# EAGLE design layout (EAGLE 9.6.2)
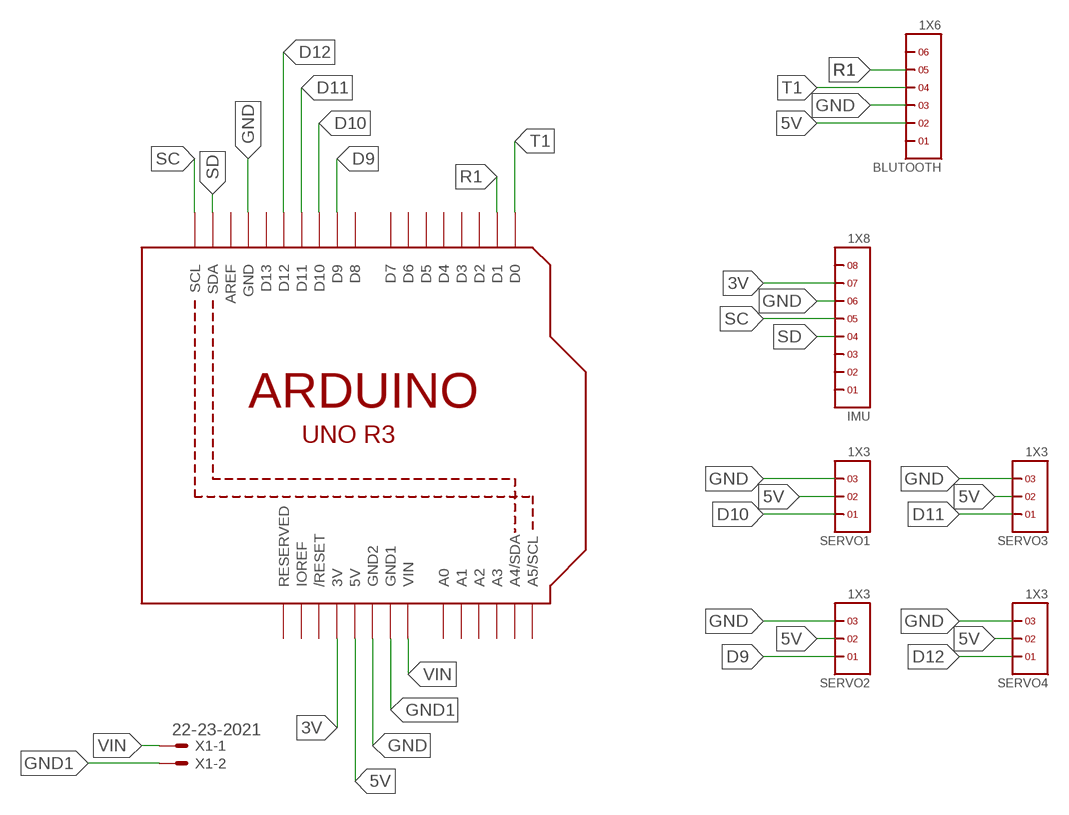
[diagram p0: schematic, sheet 1]

## Parts
BLUTOOTH  1X6  [1X6]
IMU  1X8  [1X8]
SERVO1  1X3  [1X3]
SERVO2  1X3  [1X3]
SERVO3  1X3  [1X3]
SERVO4  1X3  [1X3]
U1  ARDUINOR3-DIMENSION  [ARDUINOR3]
X1  22-23-2021  [22-23-2021]

## Nets
3V: IMU.7 U1.3V
5V: BLUTOOTH.2 SERVO1.2 SERVO2.2 SERVO3.2 SERVO4.2 U1.5V
D9: SERVO2.1 U1.D9
D10: SERVO1.1 U1.D10
D11: SERVO3.1 U1.D11
D12: SERVO4.1 U1.D12
GND: BLUTOOTH.3 IMU.6 SERVO1.3 SERVO2.3 SERVO3.3 SERVO4.3 U1.GND U1.GND2
GND1: U1.GND1 X1.2
R1: BLUTOOTH.5 U1.D1
SC: IMU.5 U1.SCL
SD: IMU.4 U1.SDA
T1: BLUTOOTH.4 U1.D0
VIN: U1.VIN X1.1
Unconnected: BLUTOOTH.1 BLUTOOTH.6 IMU.1 IMU.2 IMU.3 IMU.8 U1.A0 U1.A1 U1.A2 U1.A3 U1.A4(A4/SDA) U1.A5(A5/SCL) U1.AREF U1.D2 U1.D3 U1.D4 U1.D5 U1.D6 U1.D7 U1.D8 U1.D13 U1.IOREF U1.RESERVED U1.RESET(/RESET)

## Library data of the parts
BLUTOOTH = headers(.1in):1X6
IMU = headers(.1in):1X8
SERVO1-SERVO4 = headers(.1in):1X3
U1 = adafruit:ARDUINOR3: This is a new object for the new Arduino R3 - with extra pins that you may want to use (such as IOref, and duplicated A4/A5
X1 = con-molex:22-23-2021: .100" (2.54mm) Center Header - 2 Pin; MF: MOLEX; MPN: 22-23-2021; OC_FARNELL: 1462926; OC_NEWARK: 25C3832

## Board
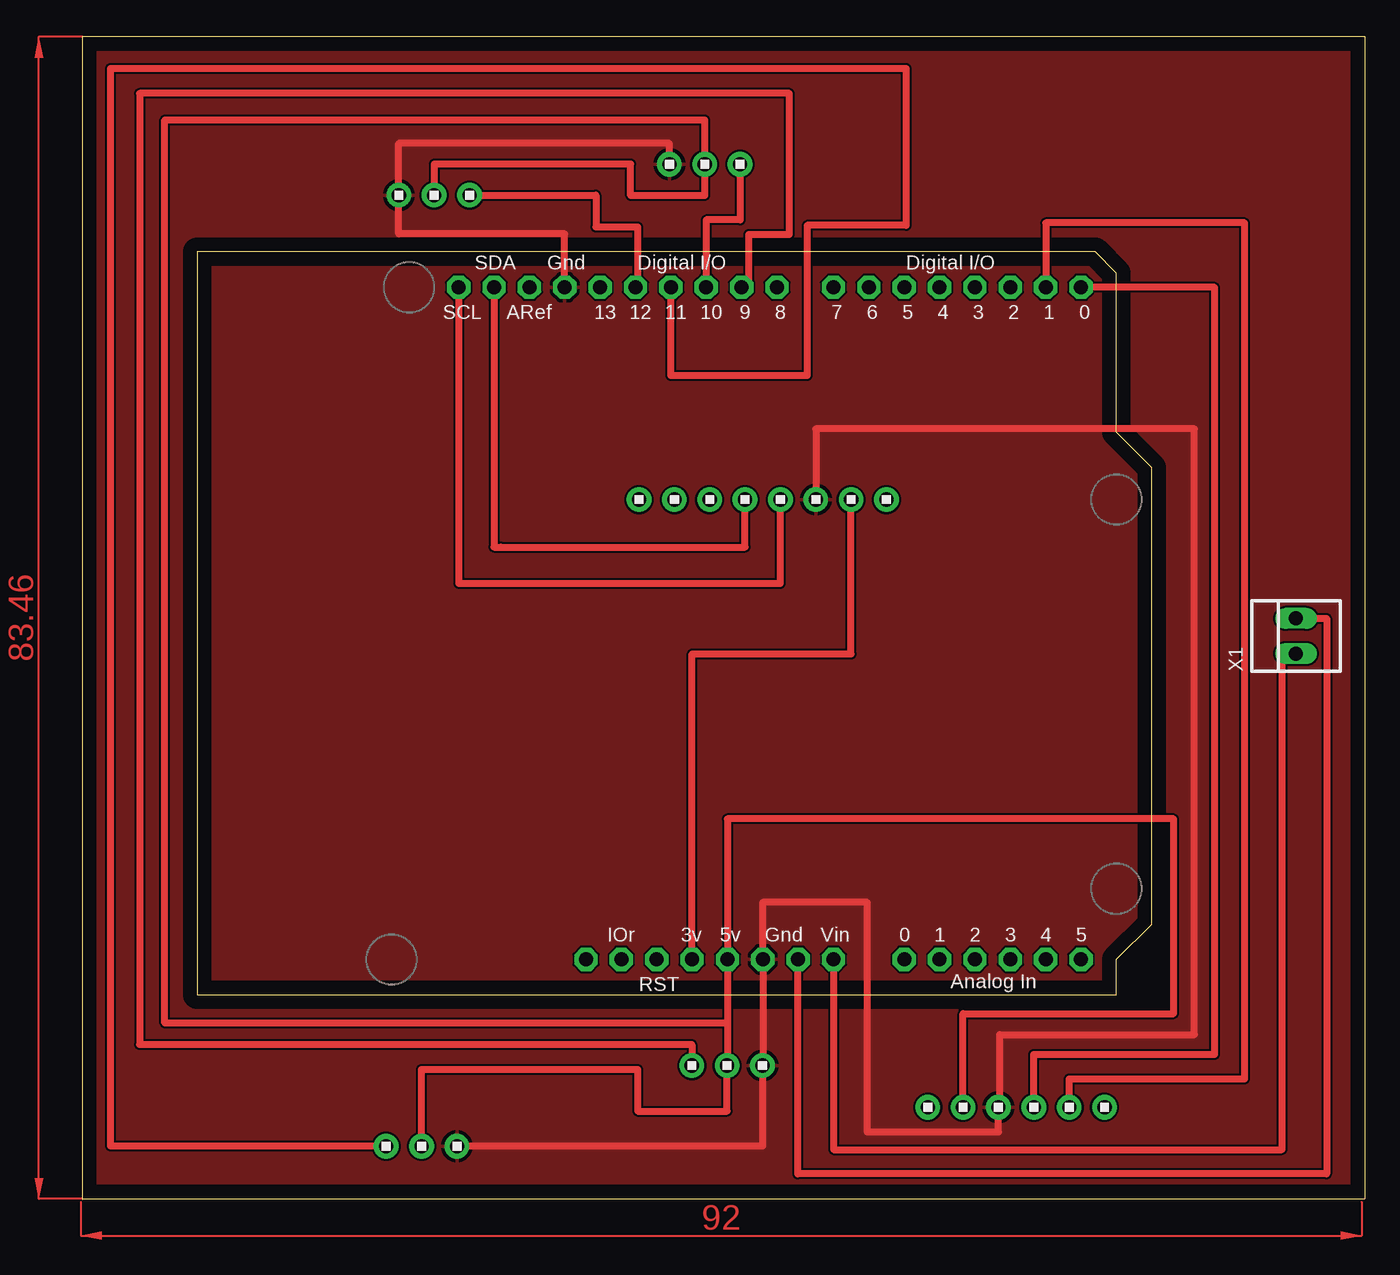
[diagram p1: board, top side]

Size 92.11 x 83.46 mm. Coordinates in mm from the lower left corner, seen from the top.
Outline: 0,0 92.11,0 92.11,83.46 0,83.46 0,0
Copper layers (1*16): Top 0.035mm / dielectric 1.5mm / Bottom 0.035mm
Design rules "default": minimum track width 6mil, minimum drill 0.35mm, track to track 6mil, track to pad 6mil, pad to pad 6mil, via to via 6mil, smd to smd 6mil, copper to edge 40mil, drill to drill 6mil, minimum pad ring 10mil, minimum via ring 8mil, stop-mask expansion 4mil, vias tented up to drill 0mil, thermal gap 10mil

### Footprints (pad centres in the part's own frame; a part is rotated, then mirrored left to right if it is on the bottom)
1X6 = drill 1.016 pad 1.778: 1 0,0; 2 2.54,0; 3 5.08,0; 4 7.62,0; 5 10.16,0; 6 12.7,0
1X8 = drill 1.016 pad 1.778: 1 0,0; 2 2.54,0; 3 5.08,0; 4 7.62,0; 5 10.16,0; 6 12.7,0; 7 15.24,0; 8 17.78,0
1X3 = drill 1.016 pad 1.778: 1 0,0; 2 2.54,0; 3 5.08,0
ARDUINOR3 = drill 1 pad 1.676 octagon: 3V 35.56,2.54; 5V 38.1,2.54; A0 50.8,2.54; A1 53.34,2.54; A2 55.88,2.54; A3 58.42,2.54; A4 60.96,2.54; A5 63.5,2.54; AREF 23.876,50.8; D0 63.5,50.8; D1 60.96,50.8; D2 58.42,50.8; D3 55.88,50.8; D4 53.34,50.8; D5 50.8,50.8; D6 48.26,50.8; D7 45.72,50.8; D8 41.656,50.8; D9 39.116,50.8; D10 36.576,50.8; D11 34.036,50.8; D12 31.496,50.8; D13 28.956,50.8; GND 26.416,50.8; GND1 43.18,2.54; GND2 40.64,2.54; IOREF 30.48,2.54; RESERVED 27.94,2.54; RESET 33.02,2.54; SCL 18.796,50.8; SDA 21.336,50.8; VIN 45.72,2.54
22-23-2021 = drill 1 long: 1 -1.27,0; 2 1.27,0

### Placement (x,y rotation side)
BLUTOOTH  60.73,6.58 0 top
IMU  39.99,50.22 0 top
SERVO1  47.25,74.29 180 top
SERVO2  43.78,9.58 0 top
SERVO3  21.83,3.79 0 top
SERVO4  27.82,72.08 180 top
U1  8.24,14.66 0 top
X1  87.17,40.42 90 top

### Tracks (layer width: path | path; a pad name or v marks a point on that pad's centre or on a via)
3V
  Top 0.5: U1.3V 43.8,39.14 55.23,39.14 IMU.7
5V
  Top 0.5: 46.34,12.62 U1.5V 46.34,27.3 78.39,27.3 78.39,13.3 63.27,13.3 BLUTOOTH.2 | 46.34,12.62 5.93,12.62 5.93,77.48 44.71,77.48 SERVO1.2 44.71,72.05 39.39,72.05 39.39,74.3 25.28,74.3 SERVO4.2 | 46.34,12.62 46.34,9.58 SERVO2.2 46.32,6.3 39.89,6.3 39.89,9.3 24.37,9.3 SERVO3.2
D9
  Top 0.5: U1.D9 47.86,65.96 47.86,69.27 50.79,69.27 50.79,79.39 4.12,79.39 4.12,11.08 43.78,11.08 SERVO2.1
D10
  Top 0.5: SERVO1.1 47.25,70.3 44.82,70.3 U1.D10
D11
  Top 0.5: SERVO3.1 2.04,3.79 2.04,81.18 59.17,81.18 59.17,69.91 52.05,69.91 52.05,59.11 42.28,59.11 U1.D11
D12
  Top 0.5: SERVO4.1 36.89,72.08 36.89,69.8 39.89,69.8 39.89,65.46 U1.D12
GND
  Top 0.5: IMU.6 52.69,55.3 79.89,55.3 79.89,11.8 65.89,11.8 65.89,6.66 BLUTOOTH.3 65.81,4.8 56.39,4.8 56.39,21.3 48.88,21.3 U1.GND2 48.89,9.61 SERVO2.3 48.86,3.8 SERVO3.3 | U1.GND 34.66,69.3 22.73,69.3 SERVO4.3 22.73,75.8 42.17,75.8 SERVO1.3
  pour Top: -8.11,84.55 94.89,84.55 94.89,-5.2 -8.11,-5.2
GND1
  Top 0.5: X1.2 89.39,41.7 89.39,1.8 51.39,1.8 51.39,17.2 U1.GND1
R1
  Top 0.5: U1.D1 69.2,70.08 83.5,70.08 83.5,8.62 70.89,8.62 BLUTOOTH.5
SC
  Top 0.5: IMU.5 50.15,44.18 27.04,44.18 U1.SCL
SD
  Top 0.5: U1.SDA 29.58,46.8 30.08,46.8 | 30.08,46.8 30.08,46.76 | 30.08,46.8 47.61,46.8 IMU.4
T1
  Top 0.5: BLUTOOTH.4 68.35,10.39 81.34,10.39 81.34,65.46 U1.D0
VIN
  Top 0.5: X1.1 86.17,39.16 86.17,3.54 53.96,3.54 U1.VIN
(copper drawn outside any net)
  shapes: Top area x2